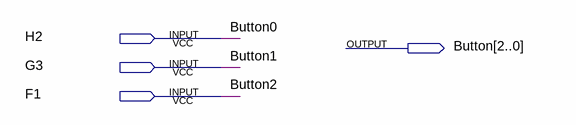
[diagram p0: schematic sheet]
// Quartus schematic Button.bdf as structural Verilog: 0 symbols, 4 pins
module Button (
  input  H2,
  input  G3,
  input  F1,
  output [2:0] Button
);


  assign Button = {F1, G3, H2};

  // Other names for the same wires on the sheet: Button0 = H2; Button1 = G3; Button2 = F1
endmodule
